# Altium schematic sheet fpga_mio.SchDoc: FPGA MIO
size A4; Organization: GPA Robotics; DocumentNumber: 3; Revision: REV 0; SheetNumber: 3; SheetTotal: 4
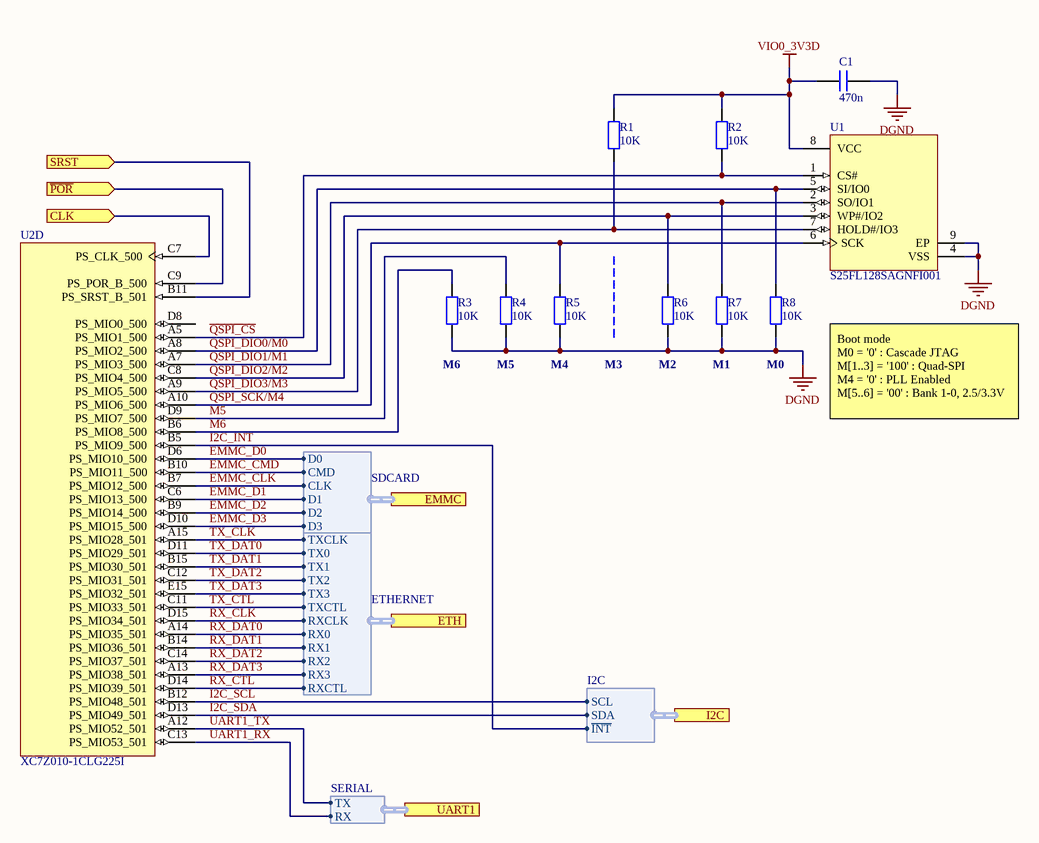
[diagram p0: fpga_mio.SchDoc]

## Parts
C1  value 470n  [CAPC1608X08N]  (hidden comment: cap)
R1  value 10K  [RESC1005X04N]  (hidden comment: res)
R2  value 10K  [RESC1005X04N]  (hidden comment: res)
R3  value 10K  [RESC1005X04N]  (hidden comment: res)
R4  value 10K  [RESC1005X04N]  (hidden comment: res)
R5  value 10K  [RESC1005X04N]  (hidden comment: res)
R6  value 10K  [RESC1005X04N]  (hidden comment: res)
R7  value 10K  [RESC1005X04N]  (hidden comment: res)
R8  value 10K  [RESC1005X04N]  (hidden comment: res)
U1  S25FL128SAGNFI001  [SPSN-WSON-8_N]
U2  XC7Z010-1CLG225I  [CLG225]  (part D of 8)

## Ports
CLK (in), EMMC (harness SDCARD), ETH (harness ETHERNET), I2C (harness I2C), SRST (in), UART1 (harness SERIAL), ~{POR} (in)

## Harnesses
I2C: SDA, SCL, ~{INT}
SDCARD: D0, D1, D2, D3, CMD, CLK
ETHERNET: TX0, TX1, TX2, TX3, RX0, RX1, RX2, RX3, TXCLK, TXCTL, RXCLK, RXCTL
SERIAL: TX, RX

## Nets
DGND: C1.1 R3.1 R4.1 R5.1 R6.1 R7.1 R8.1 U1.4(VSS) U1.9(EP)
VIO0_3V3D: C1.2 R1.2 R2.2 U1.8(VCC)
~{I2C_INT}: U2.B5(PS_MIO9_500) ; port I2C.~{INT}
~{POR}: U2.C9(PS_POR_B_500) ; port ~{POR}
~{QSPI_CS}: R2.1 U1.1(CS#) U2.A5(PS_MIO1_500)
CLK: U2.C7(PS_CLK_500) ; port CLK
EMMC_CLK: U2.B7(PS_MIO12_500) ; port EMMC.CLK
EMMC_CMD: U2.B10(PS_MIO11_500) ; port EMMC.CMD
EMMC_D0: U2.D6(PS_MIO10_500) ; port EMMC.D0
EMMC_D1: U2.C6(PS_MIO13_500) ; port EMMC.D1
EMMC_D2: U2.B9(PS_MIO14_500) ; port EMMC.D2
EMMC_D3: U2.D10(PS_MIO15_500) ; port EMMC.D3
I2C_SCL: U2.B12(PS_MIO48_501) ; port I2C.SCL
I2C_SDA: U2.D13(PS_MIO49_501) ; port I2C.SDA
M5: R4.2 U2.D9(PS_MIO7_500)
M6: R3.2 U2.B6(PS_MIO8_500)
QSPI_DIO0/M0: R8.2 U1.5(SI/IO0) U2.A8(PS_MIO2_500)
QSPI_DIO1/M1: R7.2 U1.2(SO/IO1) U2.A7(PS_MIO3_500)
QSPI_DIO2/M2: R6.2 U1.3(WP#/IO2) U2.C8(PS_MIO4_500)
QSPI_DIO3/M3: R1.1 U1.7(HOLD#/IO3) U2.A9(PS_MIO5_500)
QSPI_SCK/M4: R5.2 U1.6(SCK) U2.A10(PS_MIO6_500)
RX_CLK: U2.D15(PS_MIO34_501) ; port ETH.RXCLK
RX_CTL: U2.D14(PS_MIO39_501) ; port ETH.RXCTL
RX_DAT0: U2.A14(PS_MIO35_501) ; port ETH.RX0
RX_DAT1: U2.B14(PS_MIO36_501) ; port ETH.RX1
RX_DAT2: U2.C14(PS_MIO37_501) ; port ETH.RX2
RX_DAT3: U2.A13(PS_MIO38_501) ; port ETH.RX3
SRST: U2.B11(PS_SRST_B_501) ; port SRST
TX_CLK: U2.A15(PS_MIO28_501) ; port ETH.TXCLK
TX_CTL: U2.C11(PS_MIO33_501) ; port ETH.TXCTL
TX_DAT0: U2.D11(PS_MIO29_501) ; port ETH.TX0
TX_DAT1: U2.B15(PS_MIO30_501) ; port ETH.TX1
TX_DAT2: U2.C12(PS_MIO31_501) ; port ETH.TX2
TX_DAT3: U2.E15(PS_MIO32_501) ; port ETH.TX3
UART1_RX: U2.C13(PS_MIO53_501) ; port UART1.RX
UART1_TX: U2.A12(PS_MIO52_501) ; port UART1.TX

Not connected (* = marked no-connect by the designer): U2 D8(PS_MIO0_500)

## Notes on the sheet
- (near R3) M6
- (near R4) M5
- (near R5) M4
- M3
- (near R6) M2
- (near R7) M1
- (near R8) M0
- Boot mode
  M0 = '0' : Cascade JTAG
  M[1..3] = '100' : Quad-SPI
  M4 = '0' : PLL Enabled
  M[5..6] = '00' : Bank 1-0, 2.5/3.3V
- Title
- Size:
- Date:
- A4
- Number:
- Time:
- Revision:
- Sheet
- of
- Repo:

## Library data of the parts
C1 = cap: Capacitor; voltage: *; type: *; #digikey: *; #mouser: *
R1-R8 = res: Resistor; power: *; voltage: *; #digikey: *; #mouser: *
U1 = CMP-1329-00028-1: MirrorBit Flash Non-Volatile Memory CMOS 3.0 Volt Core with Versatile I/O, Serial Peripheral Interface with Multi-I/O, 128 Mbit, 133 MHz, -40 to 85 degC, 8-Pin WSON (WNG008), RoHS, Tube; Manufacturer: Spansion; OTP: 1024 B; Speed: 133 MHz; VCC: 2.7 to 3.6 V; ComponentLink3Description: Package Specification; ComponentLink2URL: http://www.spansion.com/Support/Datasheets/S25FL128S_256S_00.pdf; Packing: Tube; PartNumber: S25FL128SAGNFI001; PackageDescription: 8-Pin Plastic Small Outline, Body 6 x 8 mm, Pitch 1.27 mm; DatasheetVersion: Rev. 08; Temperature Range: -40 to 85 degC; ComponentLink3URL: http://www.spansion.com/Support/Datasheets/S25FL128S_256S_00.pdf; RoHS: TRUE; ComponentLink2Description: Datasheet; Density: 128 Mbit; ComponentLink1Description: Manufacturer URL; ComponentLink1URL: http://www.spansion.com/Pages/Default.aspx; Mounting Technology: Surface Mount
U2 = CMP-0382-00001-1: 667 MHz Zynq™-7000 AP SoC, 88 PS I/O, 54 FPGA I/O, 225-Ball BGA, Speed Grade 1, Industrial Grade, Pb-Free; LUTs: 17600; Extensible Block RAM (# 36Kb Blocks): 240 KB (60); Speed Grade: -1; Flip Flops: 35200; DatasheetVersion: v1.2; ComponentLink4Description: Package File; ComponentLink1URL: http://www.xilinx.com/support/documentation/data_sheets/ds190-Zynq-7000-Overview.pdf; ComponentLink5URL: http://www.xilinx.com/support/documentation/user_guides/ug865-Zynq-7000-Pkg-Pinout.pdf; ComponentLink5Description: Packaging and Pinout; PartNumber: XC7Z010-1CLG225I; PackageVersion: Rev 1.2, 02/2013; ComponentLink3Description: DC and AC Switching Characteristics; ComponentLink2URL: http://www.xilinx.com/support/documentation/user_guides/ug865-Zynq-7000-Pkg-Pinout.pdf; ComponentLink3URL: http://www.xilinx.com/support/documentation/data_sheets/ds187-XC7Z010-XC7Z020-Data-Sheet.pdf; ComponentLink6URL: http://www.xilinx.com/support/documentation/user_guides/ug483_7Series_PCB.pdf; ComponentLink2Description: Package Specification; PackageReference: CLG225; ComponentLink1Description: Datasheet; ComponentLink4URL: http://www.xilinx.com/support/packagefiles/z7packages/xc7z010clg225pkg.txt; Generic Part Number: XC7Z010; ComponentLink6Description: PCB and Layout Guide; Mounting Technology: Surface Mount; PackageDescription: Wire-Bond Chip-Scale BGA, Body 13 x 13 mm, 0.8 mm Pitch; Code_JEDEC: MO-275-HHAC-1; RoHS: Pb-Free